# EasyEDA Pro project ProProject_Open Energy Box_2024-07-22.epro, schematic Schematic, sheets 8 to 12 of 12

## Sheets
8 ETH: Page Name: ETH
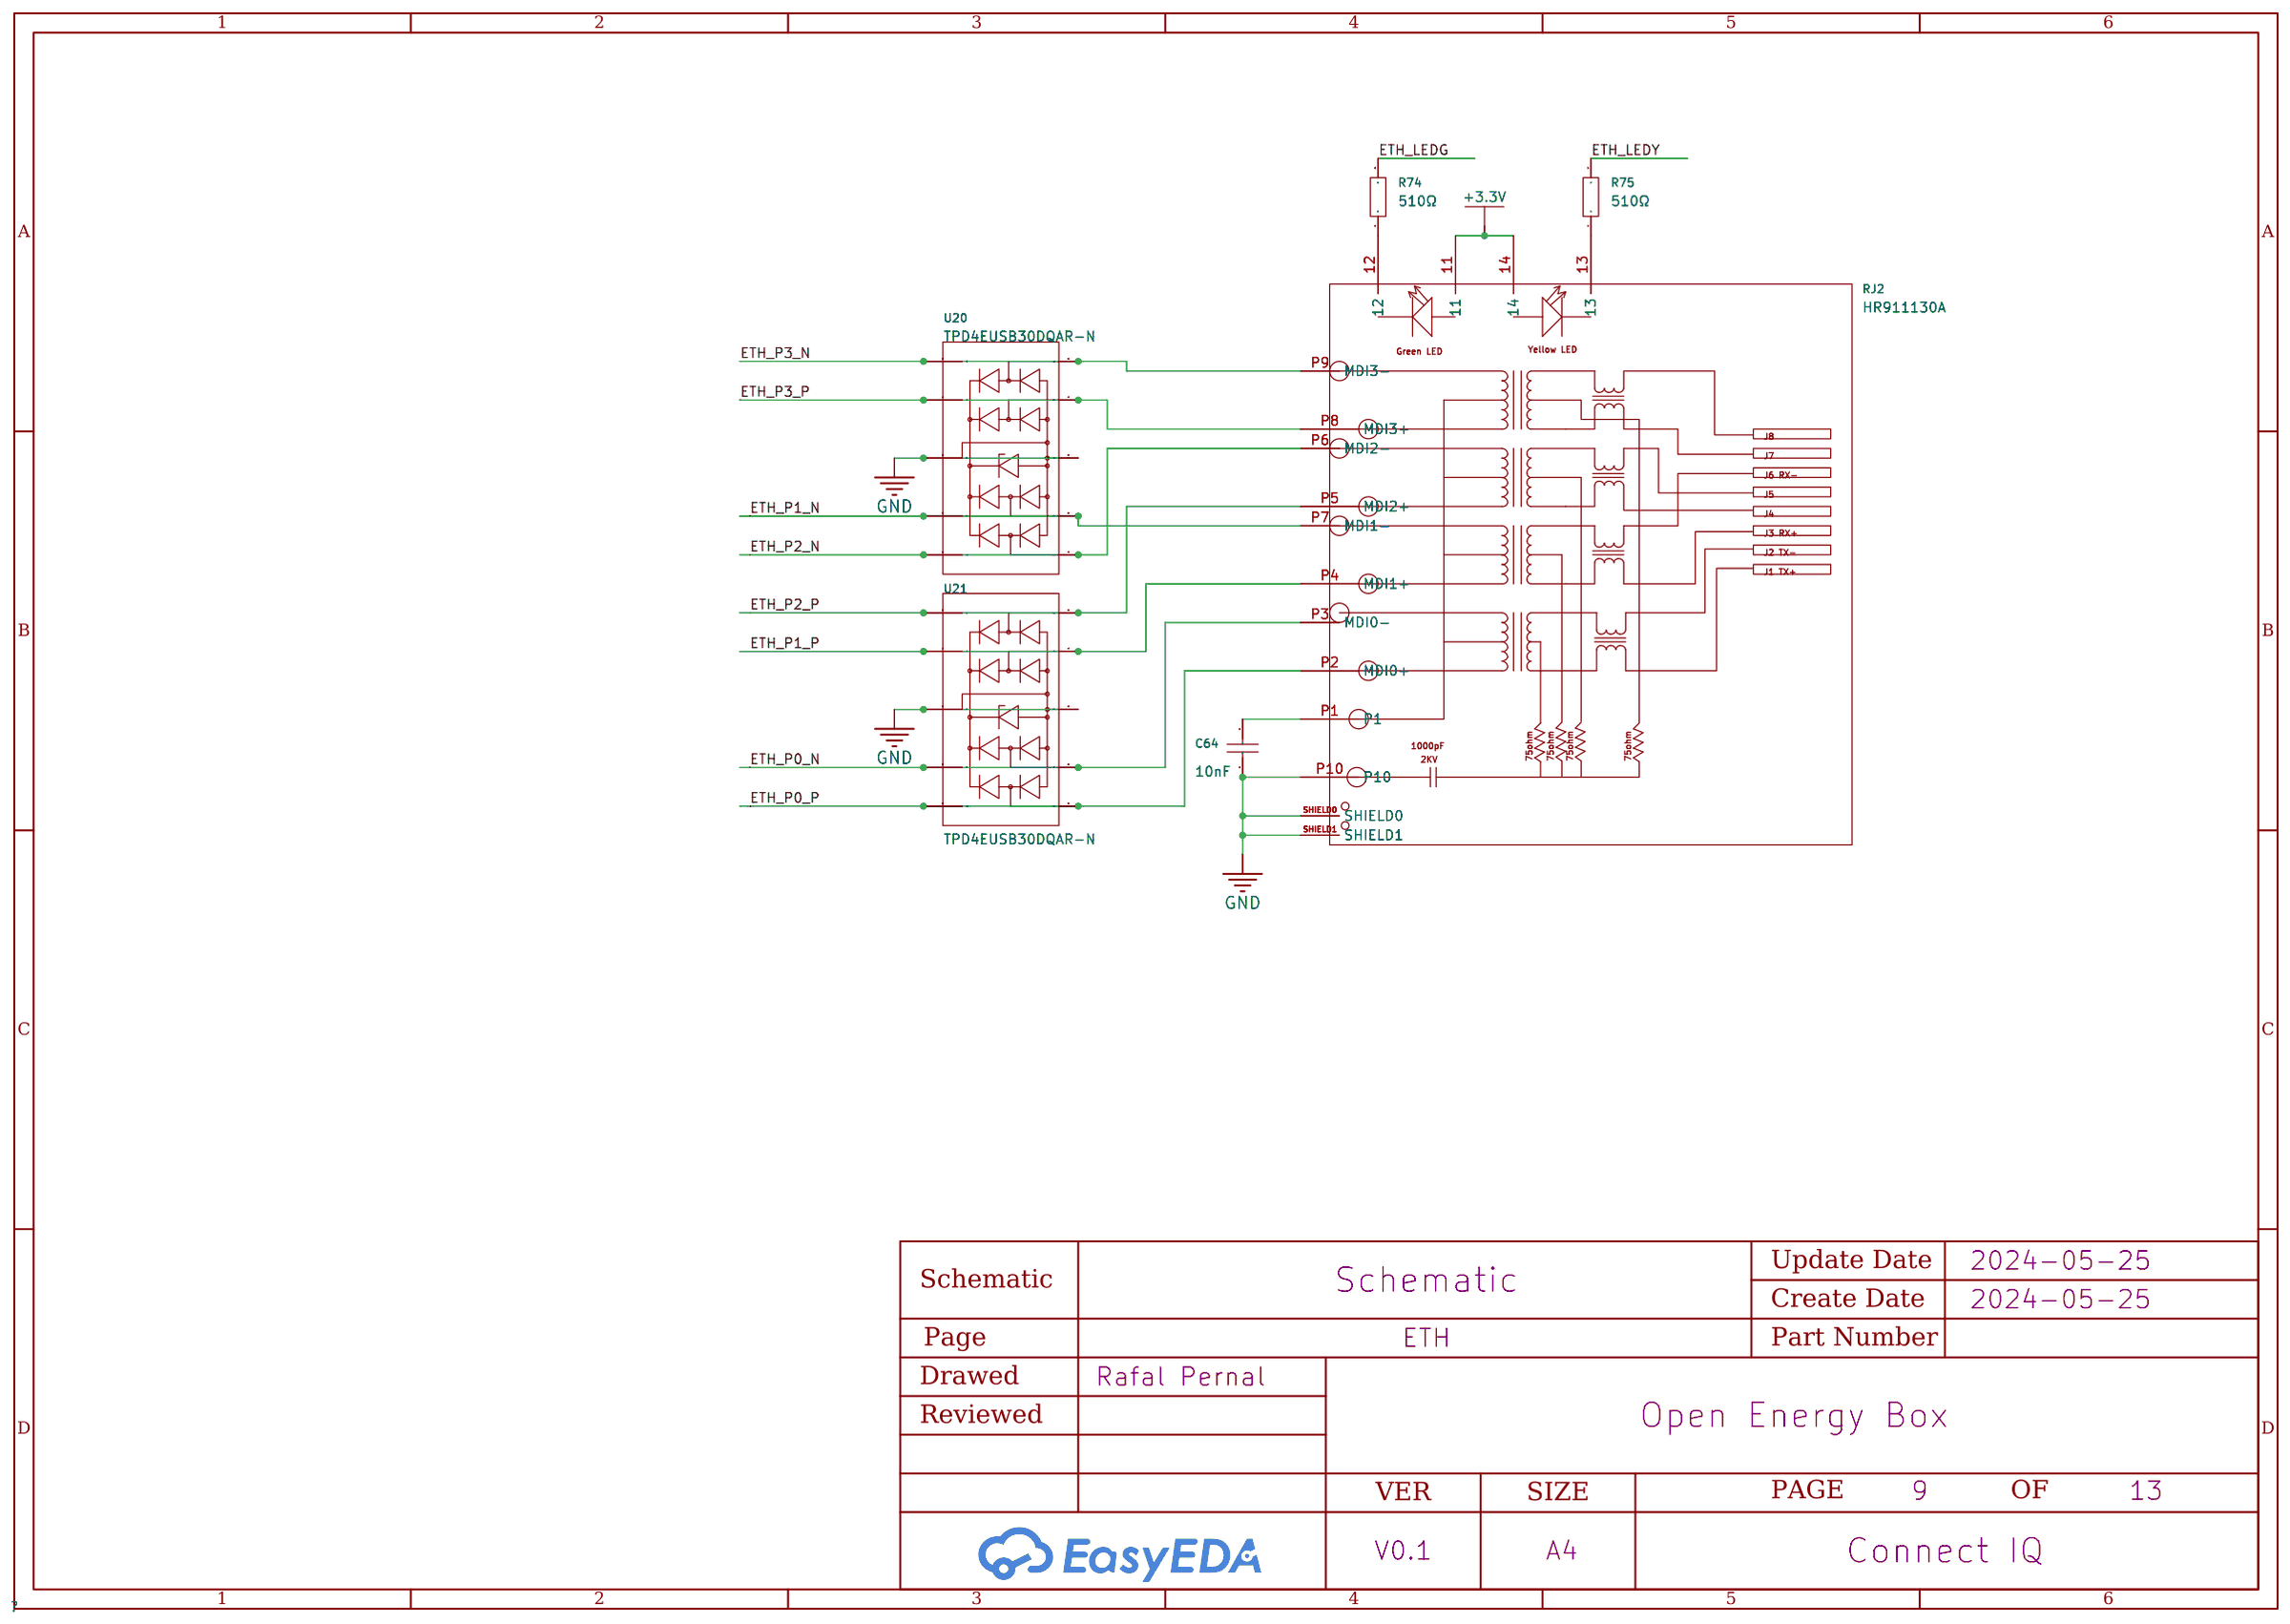
[diagram p7: ETH]
9 POWER: Page Name: POWER
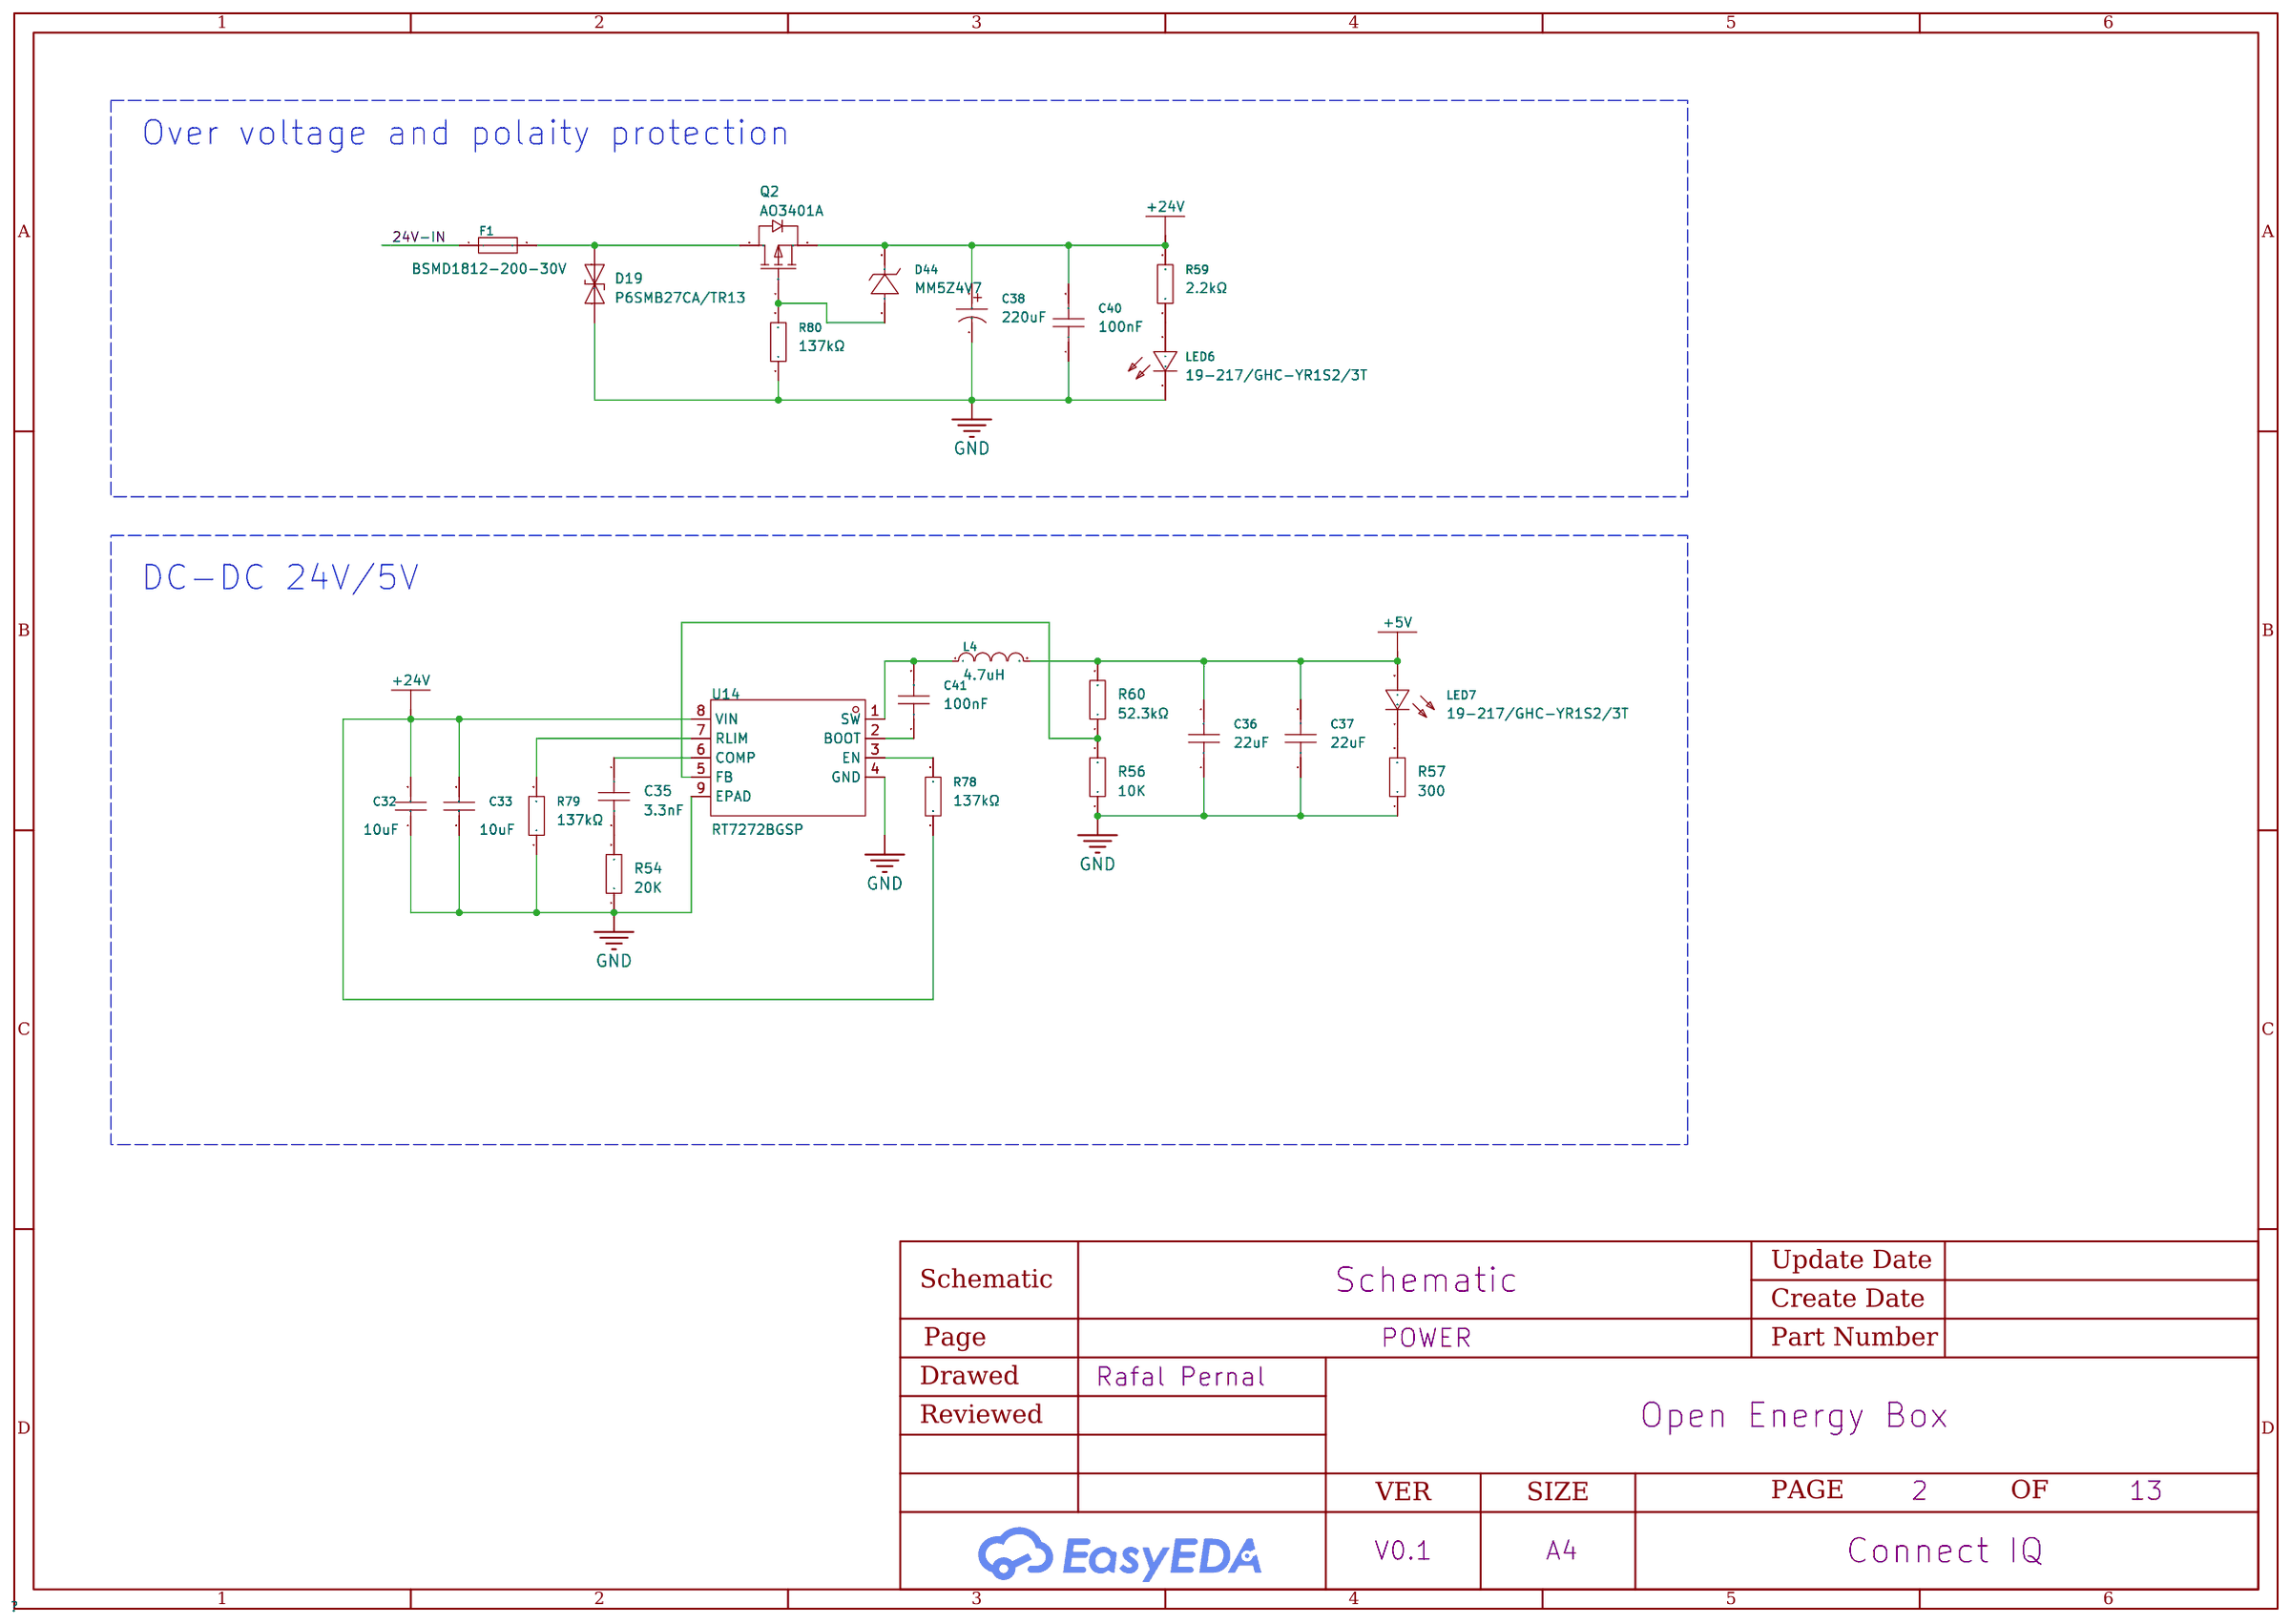
[diagram p8: POWER]
10 RTC OLED: Page Name: RTC OLED
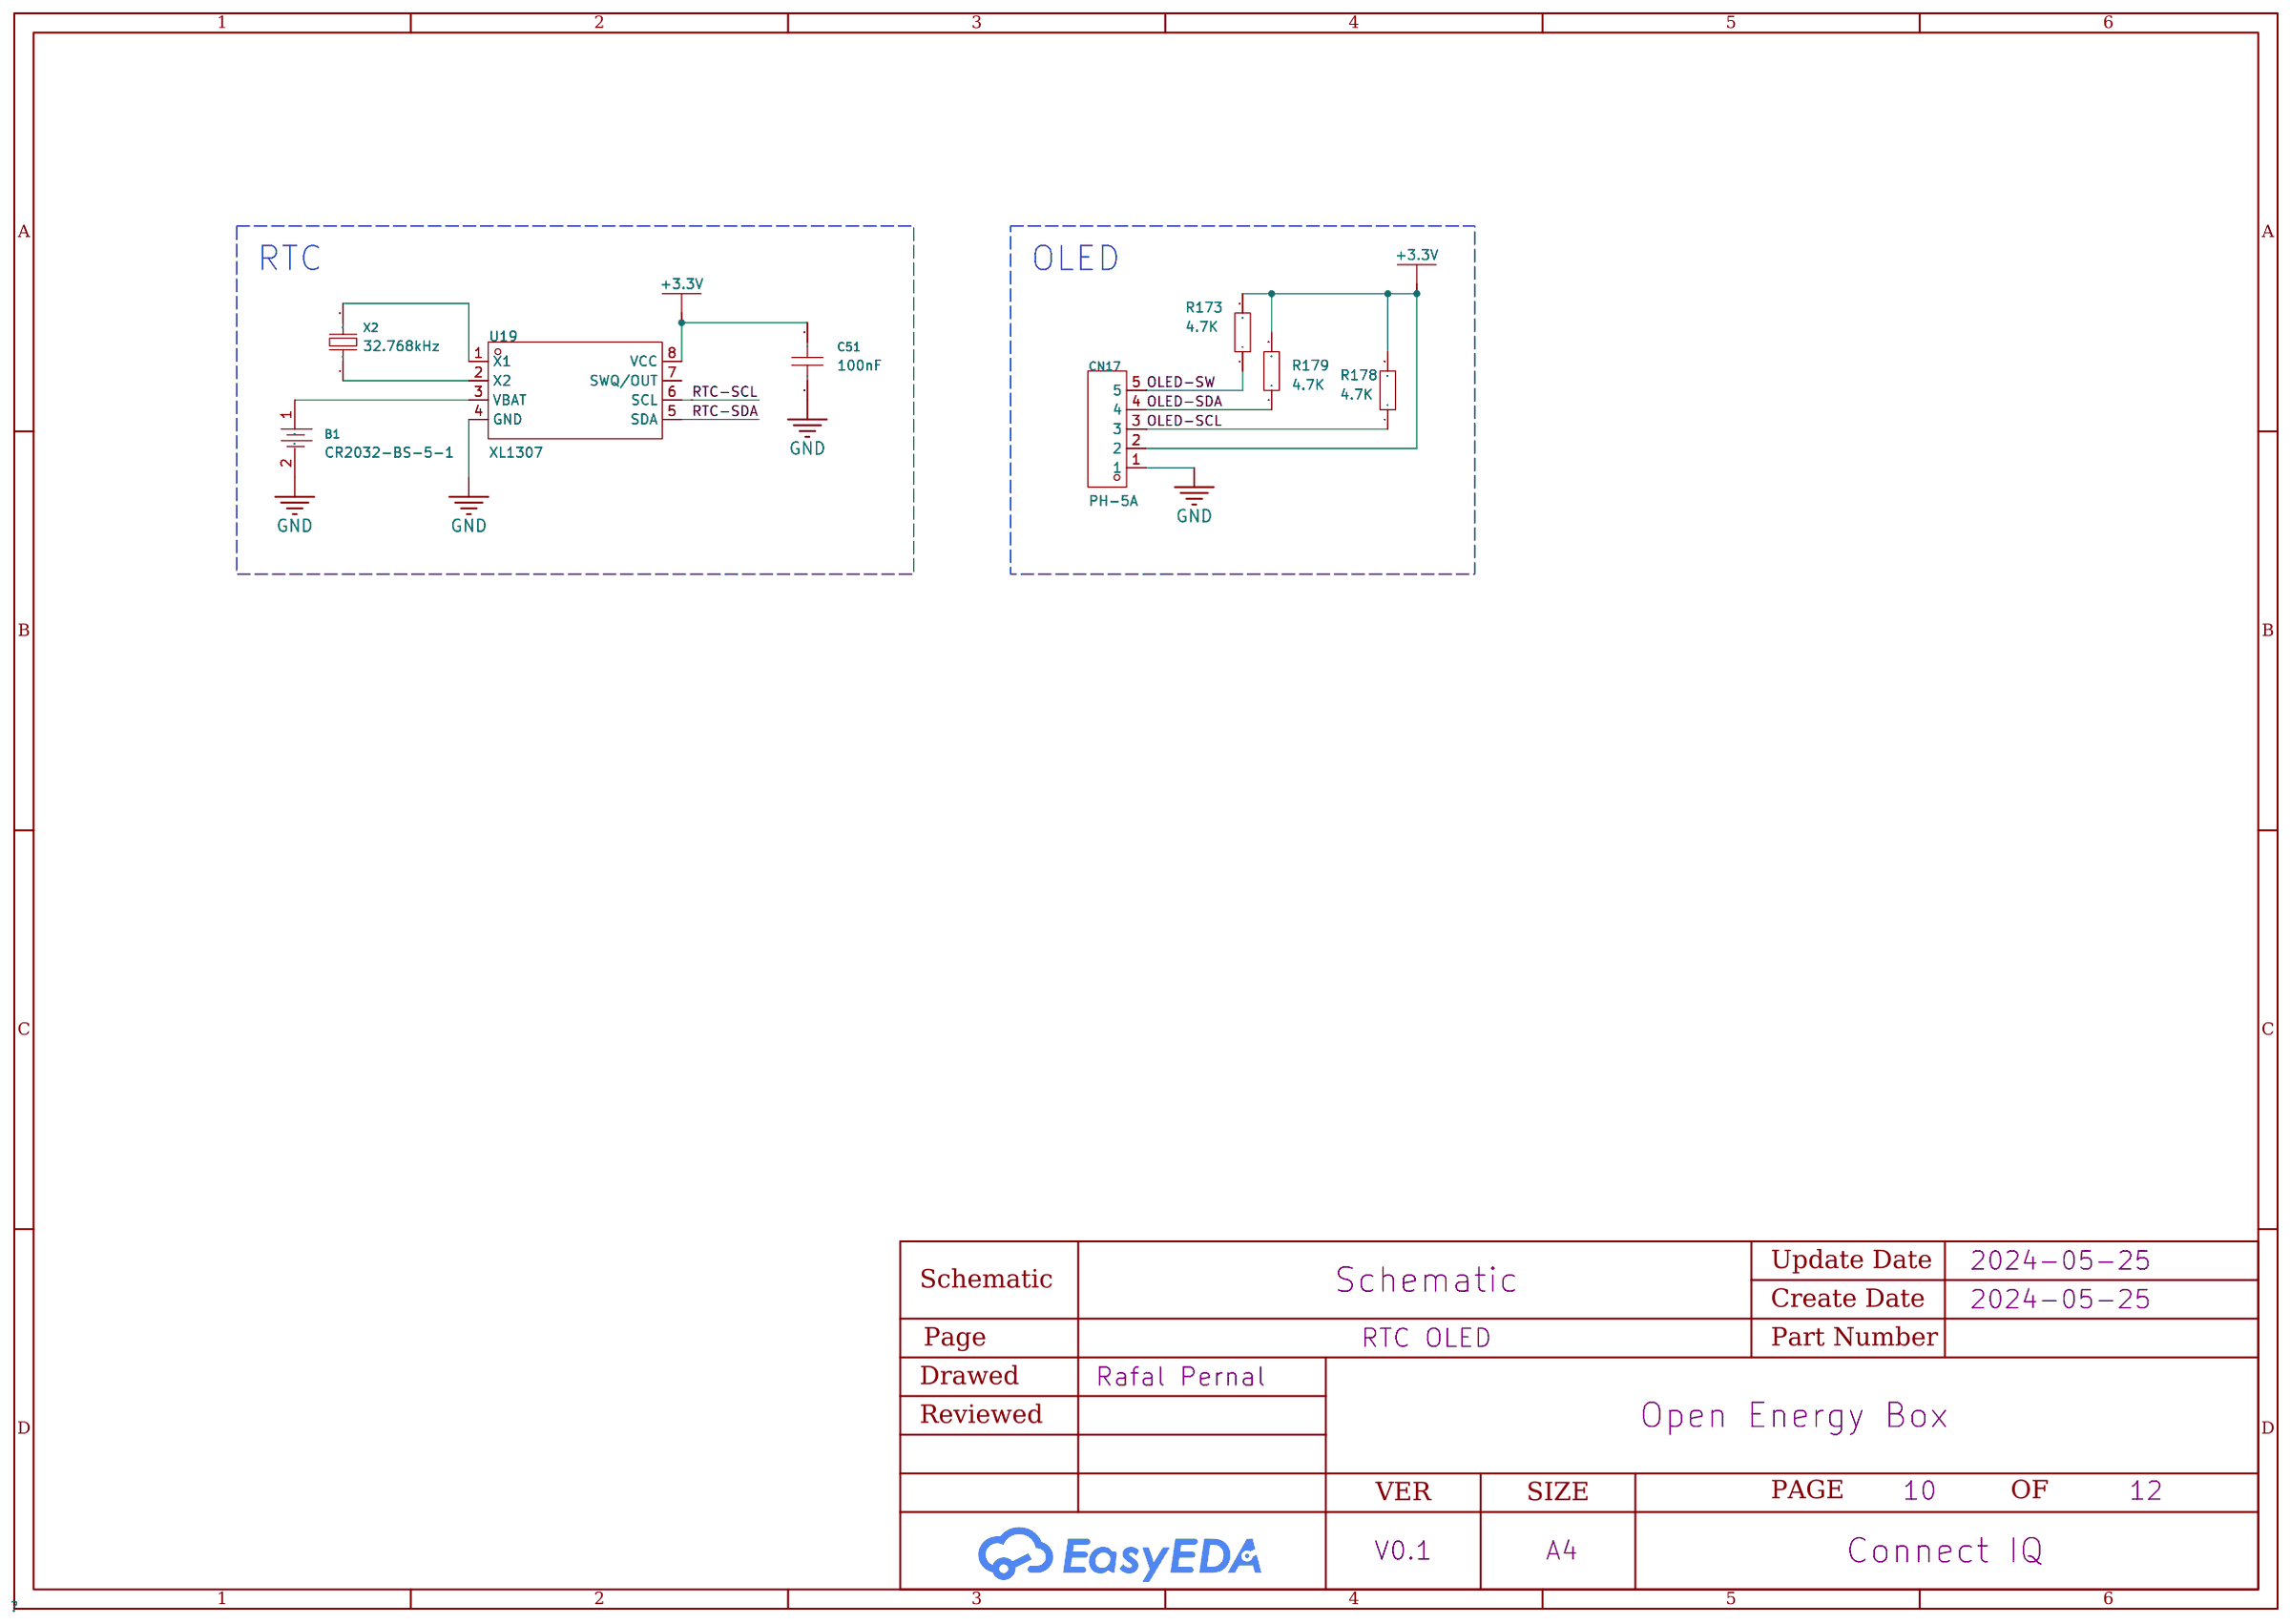
[diagram p9: RTC OLED]
11 RS485: Page Name: RS485
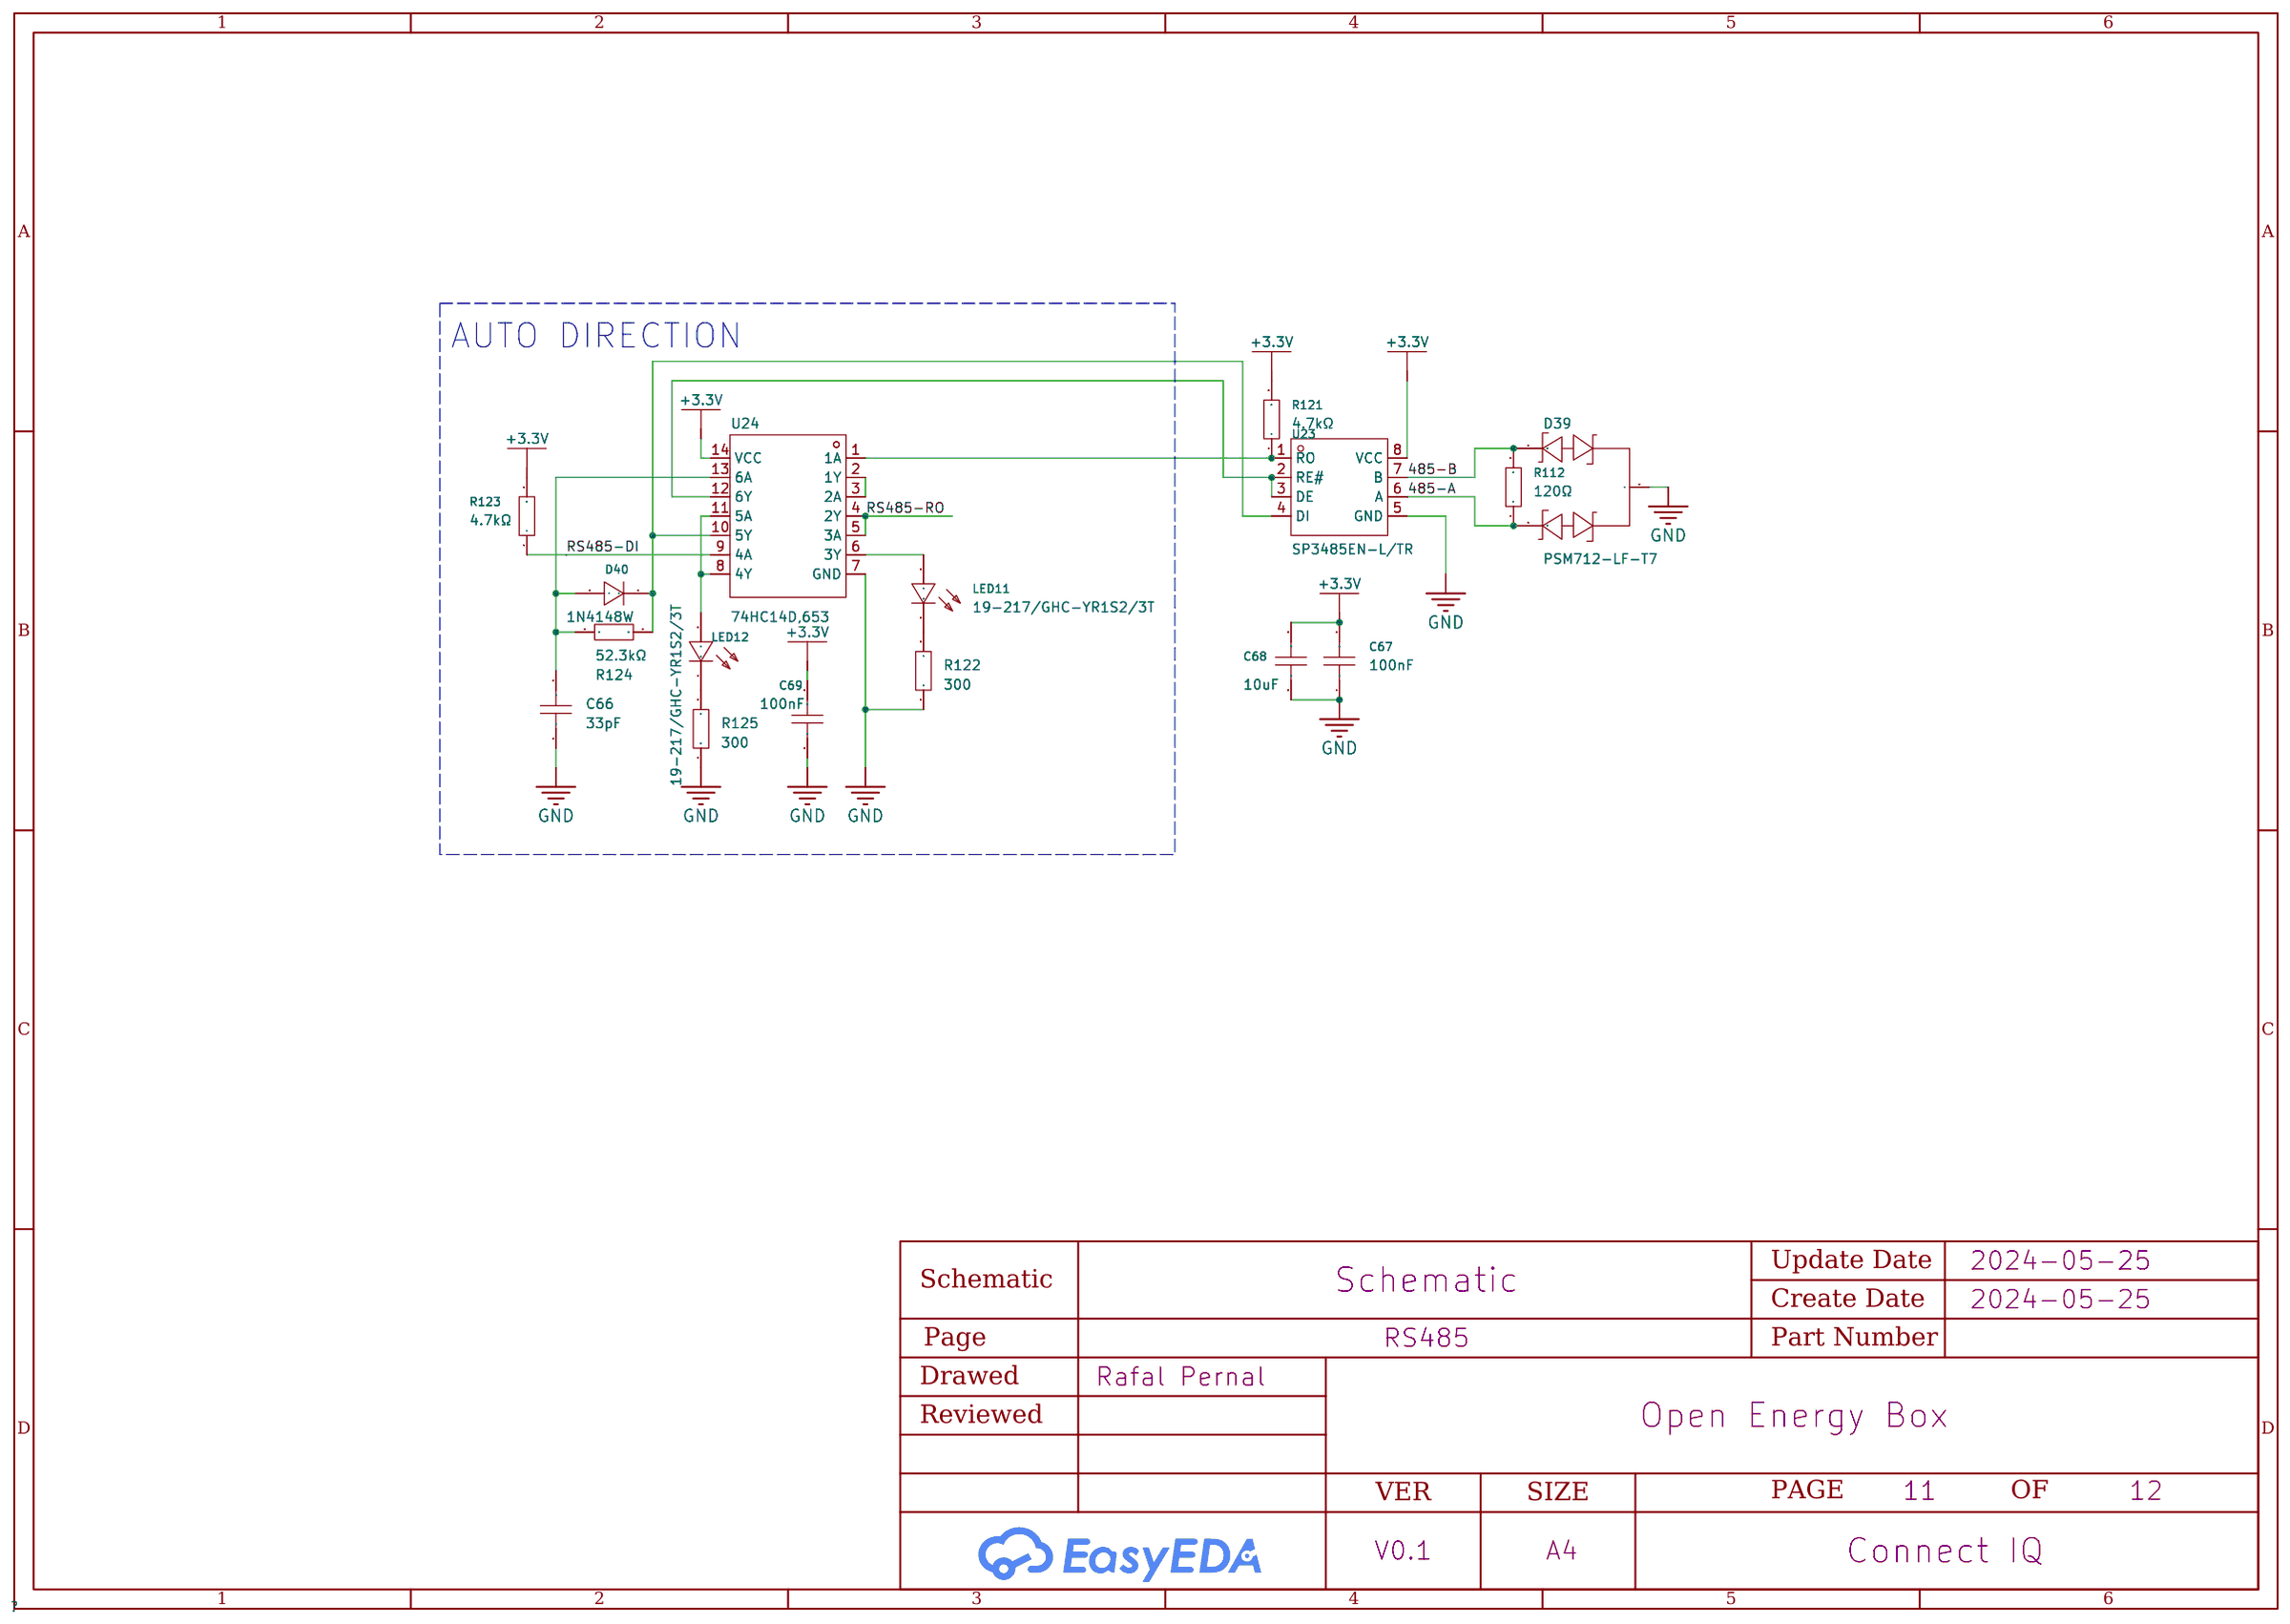
[diagram p10: RS485]
12 HDMI: Page Name: HDMI
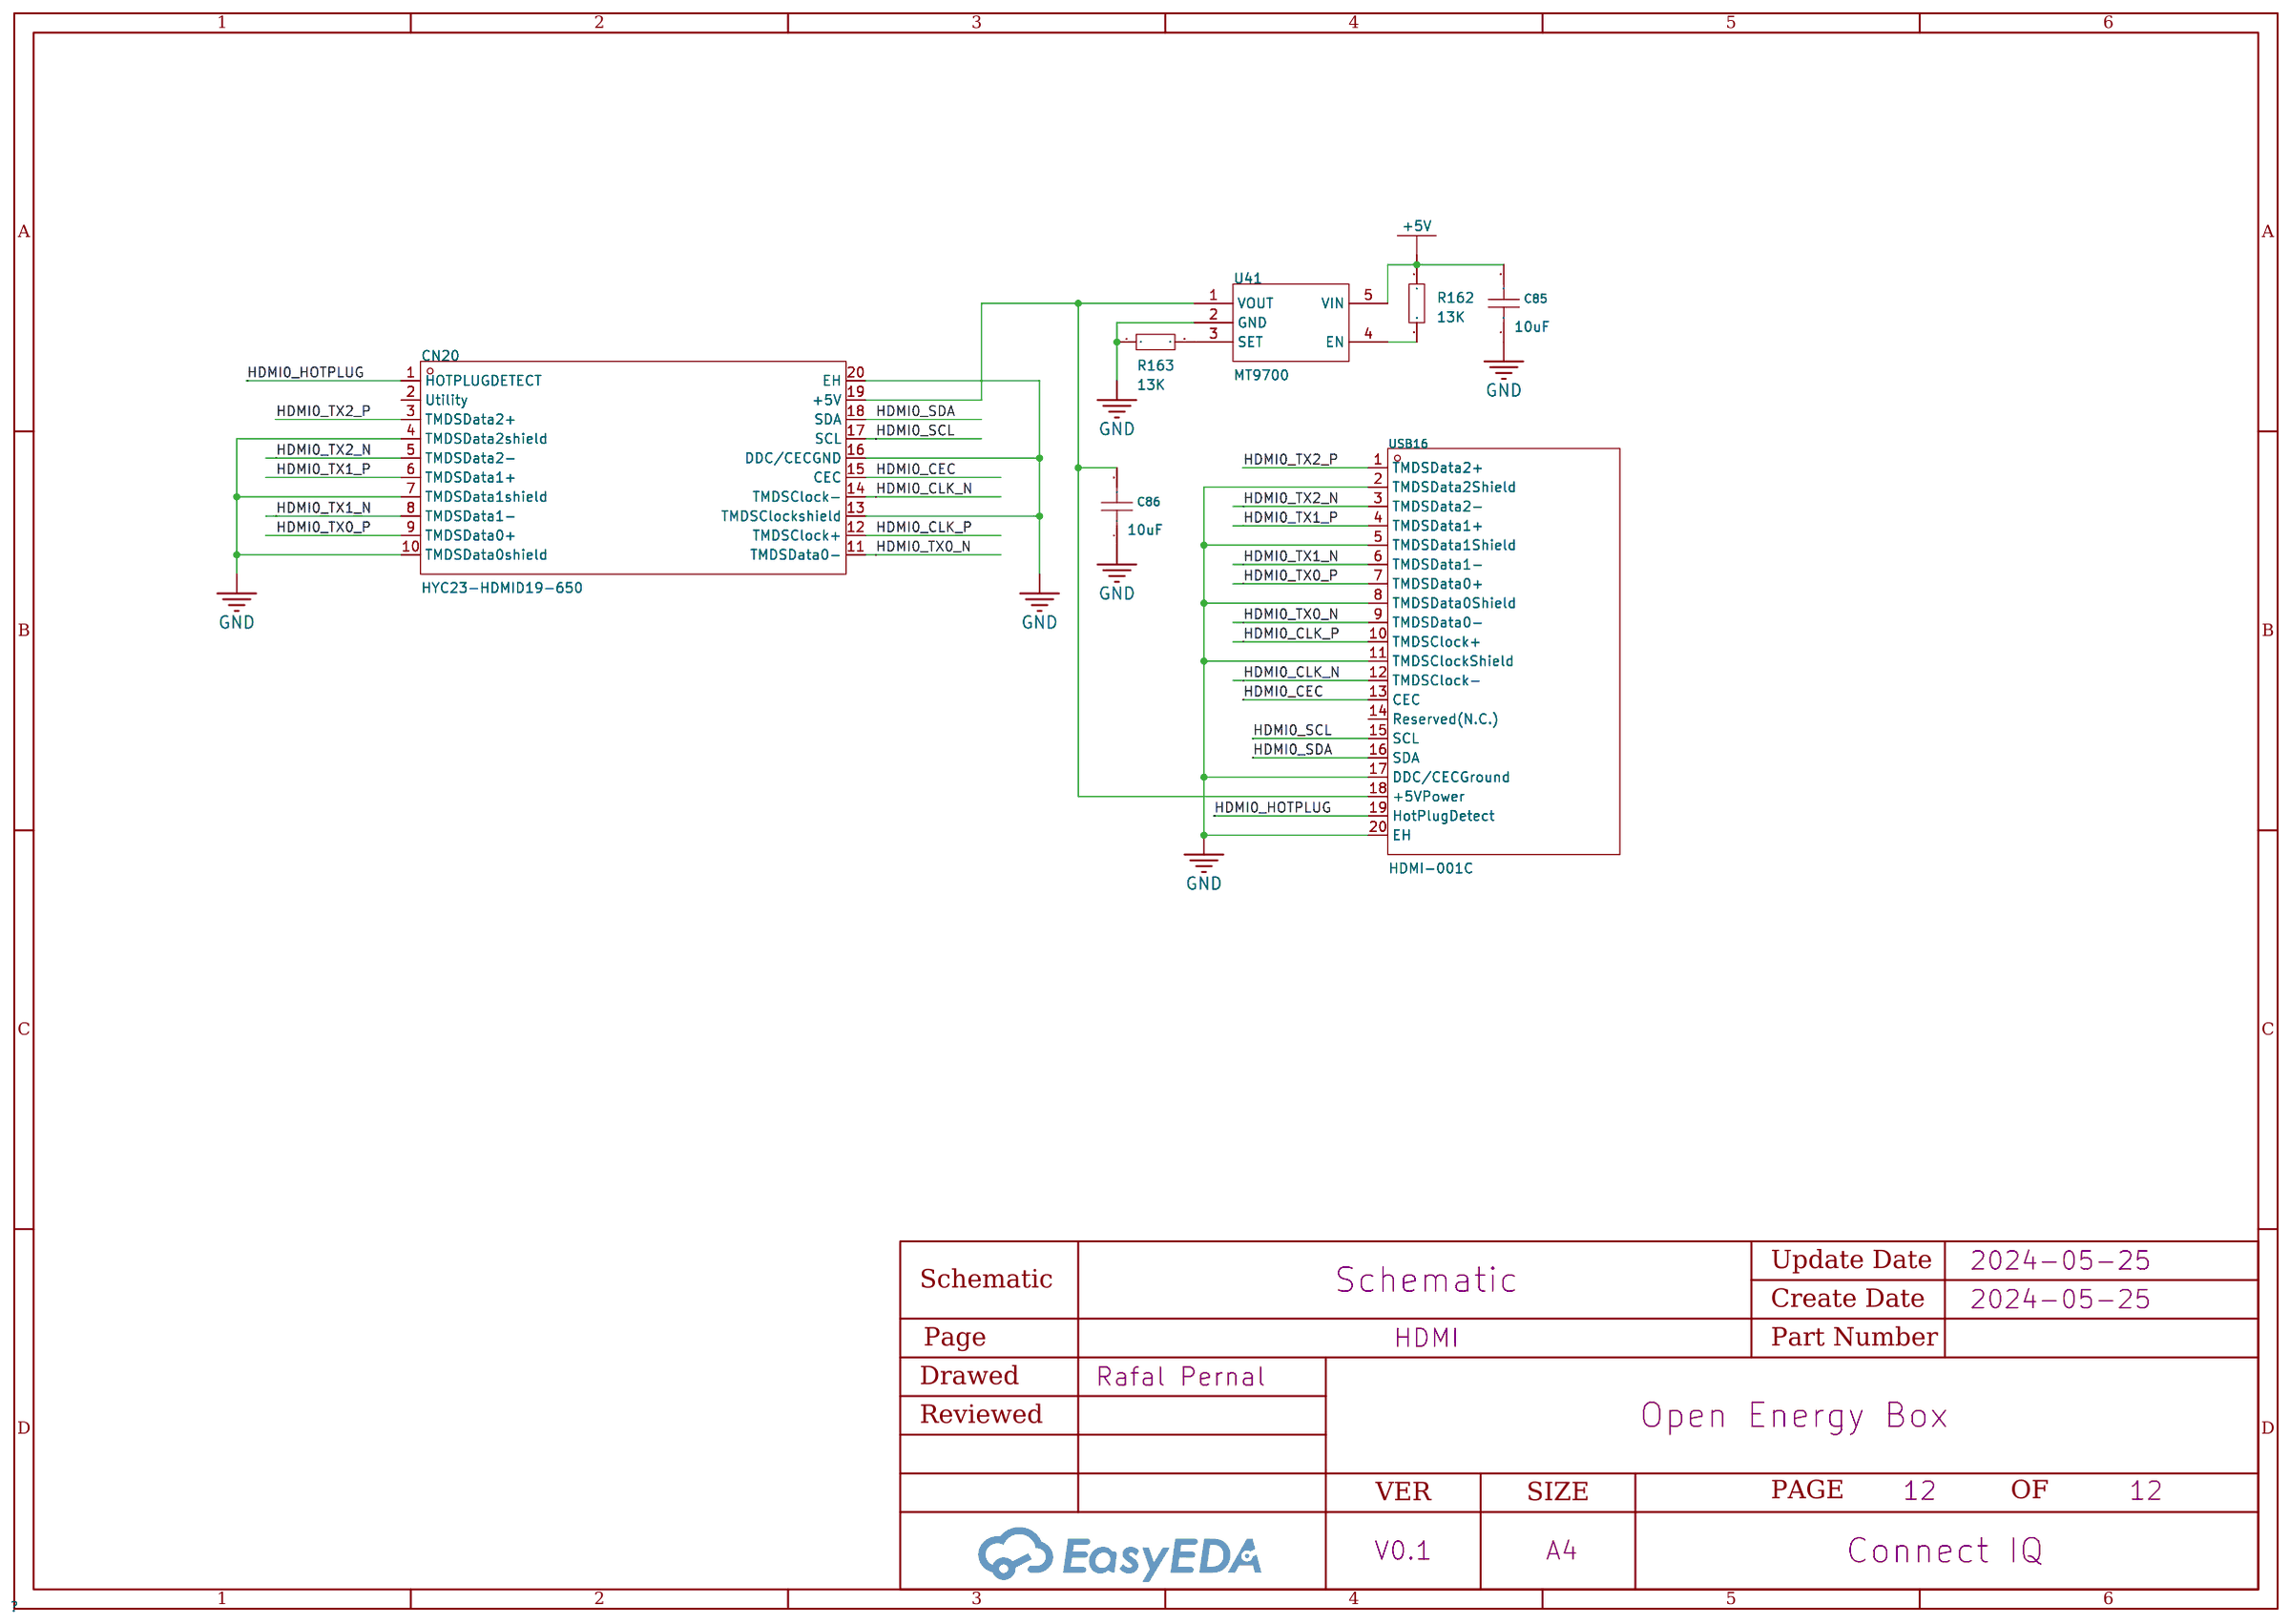
[diagram p11: HDMI]

## Parts
sheet ETH
C64  10nF  [C0603]
R74  510Ω  [R0603]
R75  510Ω  [R0603]
RJ2  HR911130A  [RJ45-TH_HR911130A]
U20  TPD4EUSB30DQAR-N  [DFN-10_L2.5-W1.0-P0.50-BL-A]
U21  TPD4EUSB30DQAR-N  [DFN-10_L2.5-W1.0-P0.50-BL-A]
sheet HDMI
C85  10uF  [C0603]
C86  10uF  [C0603]
CN20  HYC23-HDMID19-650  [AUDIO-TH_HYC23-HDMID19-650]
R162  13K  [R0603]
R163  13K  [R0603]
U41  MT9700  [SOT-23-5_L3.0-W1.7-P0.95-LS2.8-BR]
USB16  HDMI-001C  [HDMI-SMD_HDMI-001C]
sheet POWER
C32  10uF  [C1206]
C33  10uF  [C1206]
C35  3.3nF  [C0603]
C36  22uF  [C0805]
C37  22uF  [C0805]
C38  220uF  [CAP-SMD_BD10.0-L10.3-W10.3-LS11.3-FD]
C40  100nF  [C0603]
C41  100nF  [C0603]
D19  P6SMB27CA/TR13  [SMB_L4.3-W3.6-LS5.4-BI]
D44  MM5Z4V7  [SOD-523_L1.2-W0.8-LS1.6-FD]
F1  BSMD1812-200-30V  [F1812]
L4  4.7uH  [IND-SMD_L7.1-W6.6]
LED6  19-217/GHC-YR1S2/3T  [LED0603-RD]
LED7  19-217/GHC-YR1S2/3T  [LED0603-RD]
Q2  AO3401A  [SOT-23_L2.9-W1.3-P1.90-LS2.4-BR]
R54  20K  [R0603]
R56  10K  [R0603]
R57  300  [R0603]
R59  2.2kΩ  [R0603]
R60  52.3kΩ  [R0603]
R78  137kΩ  [R0603]
R79  137kΩ  [R0603]
R80  137kΩ  [R0603]
U14  RT7272BGSP  [SOIC-8_L5.0-W4.0-P1.27-LS6.0-BL-EP2.0]
sheet RS485
C66  33pF  [C0603]
C67  100nF  [C0603]
C68  10uF  [C0603]
C69  100nF  [C0603]
D39  PSM712-LF-T7  [SOT-23-3_L3.0-W1.7-P0.95-LS2.9-BR]
D40  1N4148W  [SOD-123F_L2.7-W1.6-LS3.8-RD]
LED11  19-217/GHC-YR1S2/3T  [LED0603-RD]
LED12  19-217/GHC-YR1S2/3T  [LED0603-RD]
R112  120Ω  [R0603]
R121  4.7kΩ  [R0603]
R122  300  [R0603]
R123  4.7kΩ  [R0603]
R124  52.3kΩ  [R0603]
R125  300  [R0603]
U23  SP3485EN-L/TR  [SOIC-8_L5.0-W4.0-P1.27-LS6.0-BL]
U24  74HC14D,653  [SOIC-14_L8.7-W3.9-P1.27-LS6.0-BL]
sheet RTC OLED
B1  CR2032-BS-5-1  [BAT-TH_CR2032-BS-5-1]
C51  100nF  [C0603]
CN17  PH-5A  [CONN-TH_5P-P2.00_PH-5A]
R173  4.7K  [R0603]
R178  4.7K  [R0603]
R179  4.7K  [R0603]
U19  XL1307  [SOP-8_L4.9-W3.9-P1.27-LS6.0-BL]
X2  32.768kHz  [FC-135R_L3.2-W1.5]

## Library data of the parts
C64 = 0603B103K500NT: Capacitance: Tolerance:±10% Tolerance:±10% Voltage Rated: Temperature Coefficient:; LCSC Part Name: 10nF ±10% 50V; Supplier Part: C57112; Manufacturer: FH(风华); Supplier Footprint: 0603; JLCPCB Part Class: Basic Part; Datasheet: https://atta.szlcsc.com/upload/public/pdf/source/20200305/C486355_26A10D38EF8C2A5C37091D0039909270.pdf; Supplier: LCSC; Tolerance: ±10%
R74 R75 = 0603WAF5100T5E: Resistance: Tolerance:±1% Tolerance:±1% Power(Watts): Overload Voltage (Max): Temperature Coefficient:±100ppm/℃ Temperature Coefficient:±100ppm/℃ Type:Thick Film Resistors Operating Temperature Range:-55℃~+155℃ Operating Temperature Range:-55℃~+155℃; LCSC Part Name: 510Ω ±1% 100mW 厚膜电阻; Supplier Part: C23193; Manufacturer: UNI-ROYAL(厚声); Supplier Footprint: 0603; JLCPCB Part Class: Basic Part; Datasheet: https://atta.szlcsc.com/upload/public/pdf/source/20200306/C422600_1E6D84923E4A46A82E41ADD87F860B5C.pdf; Supplier: LCSC; Tolerance: ±1%; Temperature Coefficient: ±100ppm/℃; Type: Thick Film Resistors; Operating Temperature Range: -55℃~+155℃
RJ2 = HR911130A: Connector Type:RJReceptacle USOC Codes:RJ45 Number of Ports:1 Ratings:- Shielding:- LED:WithLED; LCSC Part Name: RJ45 带LED; Supplier Part: C54408; Manufacturer: HANRUN(汉仁); Supplier Footprint: 插件; JLCPCB Part Class: Extended Part; Datasheet: https://atta.szlcsc.com/upload/public/pdf/source/20151014/1457707458393.pdf; Supplier: LCSC; Connector Type: RJReceptacle; USOC Codes: RJ45; Number of Ports: 1; LED: WithLED
U20 U21 = TPD4EUSB30DQAR-N: LCSC Part Name: TVS二极管(ESD); Supplier Part: C5148477; Manufacturer: BORN(伯恩半导体); Supplier Footprint: DFN-10L; JLCPCB Part Class: Extended Part; Datasheet: https://atta.szlcsc.com/upload/public/pdf/source/20220914/C5B302F271DD41F07FF0824DC250FA50.pdf; Supplier: LCSC
C68 C85 C86 = CL10A106KP8NNNC: Capacitance: Tolerance:±10% Tolerance:±10% Voltage Rated: Temperature Coefficient:; LCSC Part Name: 10uF ±10% 10V; Supplier Part: C19702; Manufacturer: SAMSUNG(三星); Supplier Footprint: 0603; JLCPCB Part Class: Basic Part; Datasheet: https://atta.szlcsc.com/upload/public/pdf/source/20160218/1457707763339.pdf; Supplier: LCSC; Tolerance: ±10%
CN20 = HYC23-HDMID19-650: Connector Type:HDMI Gender:Female Number of Pins:19P Mounting Style:卧贴 Number of Rows:- Current Rating (Max):300mA Operating Temperature Range:-40℃~+85℃ Operating Temperature Range:-40℃~+85℃; LCSC Part Name: HDMI 母 P数:19P; Supplier Part: C711358; Manufacturer: 华宇创; Supplier Footprint: SMD; JLCPCB Part Class: Extended Part; Datasheet: https://atta.szlcsc.com/upload/public/pdf/source/20200813/C711358_DDB700ABB9479943DC3206785BD1DD90.pdf; Supplier: LCSC; Connector Type: HDMI; Gender: Female; Number of Pins: 19P; Mounting Style: 卧贴; Current Rating (Max): 300mA; Operating Temperature Range: -40℃~+85℃
R54 R56 R57 R122 R125 R162 R163 R173 R178 R179 = Res_0603: Supplier Footprint: 0603
U41 = MT9700: Supplier Part: C89855; Manufacturer: 西安航天民芯; Supplier Footprint: SOT-23-5; JLCPCB Part Class: Extended Part; Datasheet: https://atta.szlcsc.com/upload/public/pdf/source/20170418/1492481333031.pdf; Supplier: LCSC
USB16 = HDMI-001C_C2836126: Connector Type:HDMI Gender:Female Number of Pins:19P Mounting Style:Right-Angle Number of Rows:2 Current Rating (Max):500mA Contact Material:- Contact Plating:- Operating Temperature Range:-45℃~+85℃ Operating Temperature Range:-45℃~+85℃; LCSC Part Name: HDMI 母 P数:19P; Supplier Part: C2836126; Manufacturer: XUNPU(讯普); Supplier Footprint: 插件; JLCPCB Part Class: Extended Part; Datasheet: https://atta.szlcsc.com/upload/public/pdf/source/20200810/C720617_FFAEEC9A8F7AC9847E6A422865303F15.pdf; Supplier: LCSC; Connector Type: HDMI; Gender: Female; Number of Pins: 19P; Mounting Style: Right-Angle; Number of Rows: 2; Current Rating (Max): 500mA; Operating Temperature Range: -45℃~+85℃
C32 C33 = CL31A106KBHNNNE: Capacitance: Tolerance:±10% Tolerance:±10% Voltage Rated: Temperature Coefficient:; LCSC Part Name: 10uF ±10% 50V; Supplier Part: C13585; Manufacturer: SAMSUNG(三星); Supplier Footprint: 1206; JLCPCB Part Class: Basic Part; Datasheet: https://atta.szlcsc.com/upload/public/pdf/source/20160218/1457707763339.pdf; Supplier: LCSC; Tolerance: ±10%
C35 C66 = CAP_0603: Supplier Footprint: 0603
C36 C37 = CL21A226MAQNNNE_C45783: Capacitance: Tolerance:±20% Tolerance:±20% Voltage Rated: Temperature Coefficient:; LCSC Part Name: 22uF ±20% 25V; Supplier Part: C45783; Manufacturer: SAMSUNG(三星); Manufacturer Part: CL21A226MAQNNNE; Supplier Footprint: 0805; JLCPCB Part Class: Basic Part; Datasheet: https://atta.szlcsc.com/upload/public/pdf/source/20160218/1457707763339.pdf; Supplier: LCSC; Tolerance: ±20%
C38 = UCD1H221MNL1GS: Capacitance: Tolerance:±20% Tolerance:±20% Rated Voltage: Ripple Current:350mA@120Hz Equivalent Series Resistance(ESR):- φD: L: Lifetime @ Temp:5000hrs@105℃ Operating Temperature:-55℃~+105℃ Operating Temperature:-55℃~+105℃; LCSC Part Name: 220uF ±20% 50V; Supplier Part: C116211; Manufacturer: Nichicon(尼吉康); Supplier Footprint: SMD,D10xL10mm; JLCPCB Part Class: Extended Part; Datasheet: https://atta.szlcsc.com/upload/public/pdf/source/20171116/C136294_15108221148061123704.pdf; Supplier: LCSC; Tolerance: ±20%; Ripple Current: 350mA@120Hz; Lifetime @ Temp: 5000hrs@105℃; Operating Temperature: -55℃~+105℃
C40 C41 C51 C67 C69 = CC0603KRX7R9BB104: Capacitance: Tolerance:±10% Tolerance:±10% Voltage Rated: Temperature Coefficient:; LCSC Part Name: 100nF ±10% 50V; Supplier Part: C14663; Manufacturer: YAGEO(国巨); Supplier Footprint: 0603; JLCPCB Part Class: Basic Part; Datasheet: https://atta.szlcsc.com/upload/public/pdf/source/20180910/C282072_33301C7F631E79921B82A8DAC6BCC5B3.pdf; Supplier: LCSC; Tolerance: ±10%
D19 = P6SMB27CA/TR13: Polarity:Bi-Directional Reverse Stand-Off Voltage (Vrwm):23.1V Breakdown Voltage:25.7V Reverse Leakage Current (Ir):1uA Peak Pulse Current (Ipp)@10/1000μs:16.3A Maximum Clamping Voltage:37.5V; LCSC Part Name: 双向 Vrwm:23.1V; Supplier Part: C730015; Manufacturer: Brightking(君耀电子); Supplier Footprint: SMB(DO-214AA); JLCPCB Part Class: Extended Part; Datasheet: https://atta.szlcsc.com/upload/public/pdf/source/20200427/C523079_59166269390C2E39D506F571DF3F73BD.pdf; Supplier: LCSC; Polarity: Bi-Directional; Reverse Stand-Off Voltage (Vrwm): 23.1V; Breakdown Voltage: 25.7V; Reverse Leakage Current (Ir): 1uA; Peak Pulse Current (Ipp)@10/1000μs: 16.3A; Maximum Clamping Voltage: 37.5V
D44 = MM5Z4V7: Diode Configuration:Single Zener Voltage (Nom):4.7V Reverse Leakage Current (Ir):2uA@1V Zener Voltage (Range):4.4V~5V Zener Voltage (Range):4.4V~5V Power Dissipation:200mW Zener Impedance (Zzt):80Ω Tolerance:- Tolerance:-; LCSC Part Name: MM5Z4V7 G8(G8表示丝印); Supplier Part: C2832571; Manufacturer: CBI(创基); Supplier Footprint: SOD-523; JLCPCB Part Class: Extended Part; Datasheet: https://atta.szlcsc.com/upload/public/pdf/source/20210520/C2832587_1FF830418C49D452CD1F70FB761C1A27.pdf; Supplier: LCSC; Diode Configuration: Single; Zener Voltage (Nom): 4.7V; Reverse Leakage Current (Ir): 2uA@1V; Zener Voltage (Range): 4.4V~5V; Power Dissipation: 200mW; Zener Impedance (Zzt): 80Ω
F1 = BSMD1812-200-30V: Operating Voltage (Max):30V Current Rating (Max):40A Hold Current:2A Trip Current:4A Power Dissipation:1W Resistance - Initial (Ri) (Min):20mΩ Resistance - Post Trip (R1) (Max):100mΩ Maximum Time to Trip:2s Operating Temperature:-40℃~+85℃ Operating Temper; LCSC Part Name: 30V 2A 1812自恢复; Supplier Part: C960026; Manufacturer: BHFUSE(佰宏); Supplier Footprint: 1812; JLCPCB Part Class: Extended Part; Datasheet: https://atta.szlcsc.com/upload/public/pdf/source/20230512/6ED7FF50F668B3AF958C55F12246A840.pdf; Supplier: LCSC; Operating Voltage (Max): 30V; Current Rating (Max): 40A; Hold Current: 2A; Trip Current: 4A; Power Dissipation: 1W; Resistance - Initial (Ri) (Min): 20mΩ; Resistance - Post Trip (R1) (Max): 100mΩ; Maximum Time to Trip: 2s; Operating Temperature: -40℃~+85℃
L4 = CMLO0650H4R7MTT: Inductance: Tolerance:±20% Tolerance:±20% Rated Current: Type:屏蔽电感 DC Resistance (DCR):; LCSC Part Name: 4.7uH ±20%; Supplier Part: C439009; Manufacturer: Cybermax(思博科技); Supplier Footprint: SMD; JLCPCB Part Class: Extended Part; Datasheet: https://atta.szlcsc.com/upload/public/pdf/source/20191016/C439014_8EB8B87E5A293C2FB057F0008DFF1D19.pdf; Supplier: LCSC; Tolerance: ±20%; Type: 屏蔽电感
LED6 LED7 LED11 LED12 = 19-217/GHC-YR1S2/3T: Emitted Color:Emerald Diode Configuration:- Forward Voltage (VF):3.3V Forward Voltage (VF):3.3V Forward Current:20mA Power Dissipation:110mW Lens Color:无色透明透镜 Dominant Wavelength:520nm~535nm Dominant Wavelength:520nm~535nm Peak Wavelength:518nm Color Temp; LCSC Part Name: 翠绿; Supplier Part: C72043; Manufacturer: EVERLIGHT(亿光); Supplier Footprint: 0603; JLCPCB Part Class: Basic Part; Datasheet: https://atta.szlcsc.com/upload/public/pdf/source/20160507/1462613613780.pdf; Supplier: LCSC; Emitted Color: Emerald; Forward Voltage (VF): 3.3V; Forward Current: 20mA; Power Dissipation: 110mW; Lens Color: 无色透明透镜; Dominant Wavelength: 520nm~535nm; Peak Wavelength: 518nm; Luminous Intensity: 199mcd; Viewing Angle: 120°; Operating Temperature: -40℃~+85℃
Q2 = AO3401A_C15127: Type: Drain Source Voltage (Vdss): Continuous Drain Current (Id): Power Dissipation (Pd): Drain Source On Resistance (RDS(on)@Vgs,Id):44mΩ@10V,4.3A Gate Threshold Voltage (Vgs(th)@Id):1.3V@250uA; LCSC Part Name: P沟道 30V 4A; Supplier Part: C15127; Manufacturer: AOS; Supplier Footprint: SOT-23-3L; JLCPCB Part Class: Basic Part; Datasheet: https://atta.szlcsc.com/upload/public/pdf/source/20160507/1462613609053.pdf; Supplier: LCSC; Drain Source On Resistance (RDS(on)@Vgs,Id): 44mΩ@10V,4.3A; Gate Threshold Voltage (Vgs(th)@Id): 1.3V@250uA
R59 = 0603WAF2201T5E_C4190: Resistance:2200Ω Tolerance:±1% Tolerance:±1% Power(Watts): Overload Voltage (Max): Temperature Coefficient:±100ppm/℃ Temperature Coefficient:±100ppm/℃ Type:Thick Film Resistors Operating Temperature Range:-55℃~+155℃ Operating Temperature Range:-55℃~+155℃; LCSC Part Name: 2.2kΩ ±1% 100mW 厚膜电阻; Supplier Part: C4190; Manufacturer: UNI-ROYAL(厚声); Manufacturer Part: 0603WAF2201T5E; Supplier Footprint: 0603; JLCPCB Part Class: Basic Part; Datasheet: https://atta.szlcsc.com/upload/public/pdf/source/20200306/C422600_1E6D84923E4A46A82E41ADD87F860B5C.pdf; Supplier: LCSC; Tolerance: ±1%; Temperature Coefficient: ±100ppm/℃; Type: Thick Film Resistors; Operating Temperature Range: -55℃~+155℃
R60 R124 = RTT035232FTP: Type:Thick Film Resistors Resistance: Tolerance:±1% Tolerance:±1% Power(Watts): Temperature Coefficient:±100ppm/℃ Temperature Coefficient:±100ppm/℃ Overload Voltage (Max): Operating Temperature Range:-55℃~+155℃ Operating Temperature Range:-55℃~+155℃; LCSC Part Name: 52.3kΩ ±1% 100mW; Supplier Part: C103703; Manufacturer: RALEC(旺诠); Supplier Footprint: 0603; JLCPCB Part Class: Extended Part; Datasheet: https://atta.szlcsc.com/upload/public/pdf/source/20170408/1491646309875.pdf; Supplier: LCSC; Type: Thick Film Resistors; Tolerance: ±1%; Temperature Coefficient: ±100ppm/℃; Operating Temperature Range: -55℃~+155℃
R78-R80 = 0603WAF1373T5E: Resistance:137000Ω Tolerance:±1% Tolerance:±1% Power(Watts): Overload Voltage (Max): Temperature Coefficient:±100ppm/℃ Temperature Coefficient:±100ppm/℃ Type:Thick Film Resistors Operating Temperature Range:-55℃~+155℃ Operating Temperature Range:-55℃~+155; LCSC Part Name: 137kΩ ±1% 100mW 厚膜电阻; Supplier Part: C22872; Manufacturer: UNI-ROYAL(厚声); Supplier Footprint: 0603; JLCPCB Part Class: Extended Part; Datasheet: https://atta.szlcsc.com/upload/public/pdf/source/20200306/C422600_1E6D84923E4A46A82E41ADD87F860B5C.pdf; Supplier: LCSC; Tolerance: ±1%; Temperature Coefficient: ±100ppm/℃; Type: Thick Film Resistors; Operating Temperature Range: -55℃~+155℃
U14 = RT7272BGSP: Function:Step-down type Synchronous Rectification:- Number of Outputs:- Topology:- Input Voltage:- Input Voltage:- Output Current (Max):- Switching Frequency:-; LCSC Part Name: 降压型; Supplier Part: C127866; Manufacturer: RICHTEK(立锜); Supplier Footprint: SOIC-8-EP-150mil; JLCPCB Part Class: Extended Part; Datasheet: https://atta.szlcsc.com/upload/public/pdf/source/20180403/C127866_C96022CD8724BC3A1F23EF273B4658E0.pdf; Supplier: LCSC; Function: Step-down type
D39 = PSM712-LF-T7_C32677: Polarity:Bi-Directional Reverse Stand-Off Voltage (Vrwm):12V Breakdown Voltage:13.3V Maximum Clamping Voltage:19V; LCSC Part Name: 双向 Vrwm:12V; Supplier Part: C32677; Manufacturer: PROTEK; Supplier Footprint: SOT-23; JLCPCB Part Class: Basic Part; Datasheet: https://atta.szlcsc.com/upload/public/pdf/source/20140717/1457707154667.pdf; Supplier: LCSC; Polarity: Bi-Directional; Reverse Stand-Off Voltage (Vrwm): 12V; Breakdown Voltage: 13.3V; Maximum Clamping Voltage: 19V
D40 = 1N4148W_C81598: Diode Configuration: Forward Voltage (Vf@If):1V@50mA Reverse Voltage (Vr): Average Rectified Current (Io): Power Dissipation: Reverse Leakage Current:1uA@75V Reverse Recovery Time (trr): Operating Temperature:- Operating Temperature:-; LCSC Part Name: 电压:75V 电流:150mA; Supplier Part: C81598; Manufacturer: ST(先科); Supplier Footprint: SOD-123; JLCPCB Part Class: Basic Part; Datasheet: https://atta.szlcsc.com/upload/public/pdf/source/20161024/1477288446905.pdf; Supplier: LCSC; Forward Voltage (Vf@If): 1V@50mA; Reverse Leakage Current: 1uA@75V
R112 = 0603WAF1200T5E: Resistance: Tolerance:±1% Tolerance:±1% Power(Watts): Overload Voltage (Max): Temperature Coefficient:±100ppm/℃ Temperature Coefficient:±100ppm/℃ Type:Thick Film Resistors Operating Temperature Range:-55℃~+155℃ Operating Temperature Range:-55℃~+155℃; LCSC Part Name: 120Ω ±1% 100mW 厚膜电阻; Supplier Part: C22787; Manufacturer: UNI-ROYAL(厚声); Supplier Footprint: 0603; JLCPCB Part Class: Basic Part; Datasheet: https://atta.szlcsc.com/upload/public/pdf/source/20200306/C422600_1E6D84923E4A46A82E41ADD87F860B5C.pdf; Supplier: LCSC; Tolerance: ±1%; Temperature Coefficient: ±100ppm/℃; Type: Thick Film Resistors; Operating Temperature Range: -55℃~+155℃
R121 R123 = 0603WAF4701T5E: Resistance:4700Ω Tolerance:±1% Tolerance:±1% Power(Watts): Overload Voltage (Max): Temperature Coefficient:±100ppm/℃ Temperature Coefficient:±100ppm/℃ Type:Thick Film Resistors Operating Temperature Range:-55℃~+155℃ Operating Temperature Range:-55℃~+155℃; LCSC Part Name: 4.7kΩ ±1% 100mW 厚膜电阻; Supplier Part: C23162; Manufacturer: UNI-ROYAL(厚声); Supplier Footprint: 0603; JLCPCB Part Class: Basic Part; Datasheet: https://atta.szlcsc.com/upload/public/pdf/source/20200306/C422600_1E6D84923E4A46A82E41ADD87F860B5C.pdf; Supplier: LCSC; Tolerance: ±1%; Temperature Coefficient: ±100ppm/℃; Type: Thick Film Resistors; Operating Temperature Range: -55℃~+155℃
U23 = SP3485EN-L/TR: Types:transceiver Driver/receiver:1/1 Data Rate:10Mbps Data Rate:10Mbps Supply Voltage:3.3V Supply Voltage:3.3V Operating Temperature:-40℃~+85℃ Operating Temperature:-40℃~+85℃; LCSC Part Name: 3.3V供电 10Mbps 收发器; Supplier Part: C8963; Manufacturer: MaxLinear; Supplier Footprint: SOP-8; JLCPCB Part Class: Basic Part; Datasheet: https://atta.szlcsc.com/upload/public/pdf/source/20170601/1496285796963.pdf; Supplier: LCSC; Types: transceiver; Driver/receiver: 1/1; Data Rate: 10Mbps; Supply Voltage: 3.3V; Operating Temperature: -40℃~+85℃
U24 = 74HC14D,653: Supplier Part: C5605; Manufacturer: Nexperia(安世); Supplier Footprint: SOIC-14-150mil; JLCPCB Part Class: Basic Part; Datasheet: https://atta.szlcsc.com/upload/public/pdf/source/20170209/1486607341486.pdf; Supplier: LCSC
B1 = CR2032-BS-5-1: Supplier Part: C70379; Manufacturer: Q&amp;J; Supplier Footprint: 插件; JLCPCB Part Class: Extended Part; Datasheet: https://atta.szlcsc.com/upload/public/pdf/source/20160427/1461725216620.pdf; Supplier: LCSC
CN17 = PH-5A_C2322: Pins Structure:1x5P Pitch:2mm Mounting Style:- Row Spacing:- Number of Pins:5P Number of Rows:1 Number of PINs Per Row:5 Reference Series:PH Contact Material:-; LCSC Part Name: 1x5P 间距:2mm 系列:PH 直插; Supplier Part: C2322; Manufacturer: BOOMELE(博穆精密); Supplier Footprint: 插件,P=2mm; JLCPCB Part Class: Extended Part; Datasheet: https://atta.szlcsc.com/upload/public/pdf/source/20151118/1457707580582.pdf; Supplier: LCSC; Pins Structure: 1x5P; Pitch: 2mm; Number of Pins: 5P; Number of Rows: 1; Number of PINs Per Row: 5; Reference Series: PH
U19 = XL1307: LCSC Part Name: 实时时钟; Supplier Part: C707071; Manufacturer: XINLUDA(信路达); Supplier Footprint: SOP-8; JLCPCB Part Class: Extended Part; Datasheet: https://atta.szlcsc.com/upload/public/pdf/source/20200724/C707071_A4A06B98C9144DA5D11788F1AF9485A2.pdf; Supplier: LCSC
X2 = Q13FC1350000400: Crystal Type:SMD Crystal Resonator Frequency: Load Capacitance: Equivalent Series Resistance (ESR):70kΩ Frequency Tolerance:±20ppm Frequency Tolerance:±20ppm Operating Temperature: Operating Temperature:; LCSC Part Name: 32.768kHz ±20ppm 12.5pF; Supplier Part: C32346; Manufacturer: EPSON(爱普生); Supplier Footprint: SMD3215-2P; JLCPCB Part Class: Basic Part; Datasheet: https://atta.szlcsc.com/upload/public/pdf/source/20190108/C32346_746D6B07EAF90824457A96480007685F.pdf; Supplier: LCSC; Crystal Type: SMD Crystal Resonator; Equivalent Series Resistance (ESR): 70kΩ; Frequency Tolerance: ±20ppm

## Nets
24V-IN: F1.1 ; also on sheet 6
+3.3V: C51.2 C67.2 C68.2 C69.2 CN17.2 R121.2 R123.2 R173.2 R178.2 R179.2 RJ2.11 RJ2.14 U19.8(VCC) U23.8(VCC) U24.14(VCC) ; also on sheet 1 4 5 6 7
+5V: C36.2 C37.2 C85.2 L4.2 LED7.2(A) R60.2 R162.1 U41.5(VIN) ; also on sheet 1 7
+24V: C32.2 C33.2 C38.1 C40.2 D44.2(K) Q2.2(S) R59.2 R78.1 U14.8(VIN) ; also on sheet 2 3
GND: B1.2 C32.1 C33.1 C36.1 C37.1 C38.2 C40.1 C51.1 C64.1 C66.2 C67.1 C68.1 C69.1 C85.1 C86.1 CN17.1 CN20.4(TMDSData2shield) CN20.7(TMDSData1shield) CN20.10(TMDSData0shield) CN20.13(TMDSClockshield) CN20.16(DDC/CECGND) CN20.20(EH) D19.1 D39.3(K) LED6.1(C) R54.1 R56.1 R57.1 R79.1 R80.1 R122.1 R125.1 R163.1 RJ2.P10 RJ2.SHIELD0 RJ2.SHIELD1 U14.4(GND) U14.9(EPAD) U19.4(GND) U20.3 U20.8 U21.3 U21.8 U23.5(GND) U24.7(GND) U41.2(GND) USB16.2(TMDSData2Shield) USB16.5(TMDSData1Shield) USB16.8(TMDSData0Shield) USB16.11(TMDSClockShield) USB16.17(DDC/CECGround) USB16.20(EH) ; also on sheet 1 2 3 4 5 6 7
485-A: D39.2(A1) R112.1 U23.6(A) ; also on sheet 5
485-B: D39.1(A1) R112.2 U23.7(B) ; also on sheet 5
ETH_LEDG: R74.2 ; also on sheet 1
ETH_LEDY: R75.2 ; also on sheet 1
ETH_P0_N: RJ2.P3(MDI0-) U21.2 U21.9 ; also on sheet 1
ETH_P0_P: RJ2.P2(MDI0+) U21.1 U21.10 ; also on sheet 1
ETH_P1_N: RJ2.P7(MDI1-) U20.2 U20.9 ; also on sheet 1
ETH_P1_P: RJ2.P4(MDI1+) U21.4 U21.7 ; also on sheet 1
ETH_P2_N: RJ2.P6(MDI2-) U20.1 U20.10 ; also on sheet 1
ETH_P2_P: RJ2.P5(MDI2+) U21.5 U21.6 ; also on sheet 1
ETH_P3_N: RJ2.P9(MDI3-) U20.5 U20.6 ; also on sheet 1
ETH_P3_P: RJ2.P8(MDI3+) U20.4 U20.7 ; also on sheet 1
HDMI0_CEC: CN20.15(CEC) USB16.13(CEC) ; also on sheet 1
HDMI0_CLK_N: CN20.14(TMDSClock-) USB16.12(TMDSClock-) ; also on sheet 1
HDMI0_CLK_P: CN20.12(TMDSClock+) USB16.10(TMDSClock+) ; also on sheet 1
HDMI0_HOTPLUG: CN20.1(HOTPLUGDETECT) USB16.19(HotPlugDetect) ; also on sheet 1
HDMI0_SCL: CN20.17(SCL) USB16.15(SCL) ; also on sheet 1
HDMI0_SDA: CN20.18(SDA) USB16.16(SDA) ; also on sheet 1
HDMI0_TX0_N: CN20.11(TMDSData0-) USB16.9(TMDSData0-) ; also on sheet 1
HDMI0_TX0_P: CN20.9(TMDSData0+) USB16.7(TMDSData0+) ; also on sheet 1
HDMI0_TX1_N: CN20.8(TMDSData1-) USB16.6(TMDSData1-) ; also on sheet 1
HDMI0_TX1_P: CN20.6(TMDSData1+) USB16.4(TMDSData1+) ; also on sheet 1
HDMI0_TX2_N: CN20.5(TMDSData2-) USB16.3(TMDSData2-) ; also on sheet 1
HDMI0_TX2_P: CN20.3(TMDSData2+) USB16.1(TMDSData2+) ; also on sheet 1
OLED-SCL: CN17.3 R178.1 ; also on sheet 1
OLED-SDA: CN17.4 R179.1 ; also on sheet 1
OLED-SW: CN17.5 R173.1 ; also on sheet 1
RS485-DI: R123.1 U24.9(4A) ; also on sheet 1
RS485-RO: U24.4(2Y) U24.5(3A) ; also on sheet 1
RTC-SCL: U19.6(SCL) ; also on sheet 1
RTC-SDA: U19.5(SDA) ; also on sheet 1
$10N893: R74.1 RJ2.12
$10N932: R75.1 RJ2.13
$10N1050: C64.2 RJ2.P1
$11N516: C41.1 U14.2(BOOT)
$11N517: R79.2 U14.7(RLIM)
$11N518: C35.2 R54.2
$11N520: C35.1 U14.6(COMP)
$11N522: C41.2 L4.1 U14.1(SW)
$11N523: R56.2 R60.1 U14.5(FB)
$11N688: D19.2 F1.2 Q2.3(D)
$11N1410: LED6.2(A) R59.1
$11N1498: LED7.1(C) R57.2
$11N1535: D44.1(A) Q2.1(G) R80.2
$11N1753: R78.2 U14.3(EN)
$12N169: U19.2(X2) X2.1
$12N209: U19.1(X1) X2.2
$12N478: B1.1 U19.3(VBAT)
$13N464: R121.1 U23.1(RO) U24.1(1A)
$13N468: U24.2(1Y) U24.3(2A)
$13N546: LED11.1(C) R122.2
$13N562: LED11.2(A) U24.6(3Y)
$13N572: U23.2(RE#) U23.3(DE) U24.12(6Y)
$13N628: LED12.2(A) U24.8(4Y) U24.11(5A)
$13N846: D40.1(K) R124.1 U23.4(DI) U24.10(5Y)
$13N921: C66.1 D40.2(A) R124.2 U24.13(6A)
$13N1208: LED12.1(C) R125.2
$17N688: R163.2 U41.3(SET)
$17N692: R162.2 U41.4(EN)
$17N2555: C86.2 CN20.19(+5V) U41.1(VOUT) USB16.18(+5VPower)

Not connected (* = marked no-connect by the designer): CN20 2(Utility); U19 7(SWQ/OUT); USB16 14(Reserved(N.C.))

## Notes on the sheets
sheet 9
- Over voltage and polaity protection
- DC-DC 24V/5V
sheet 10
- RTC
- OLED
sheet 11
- AUTO DIRECTION
